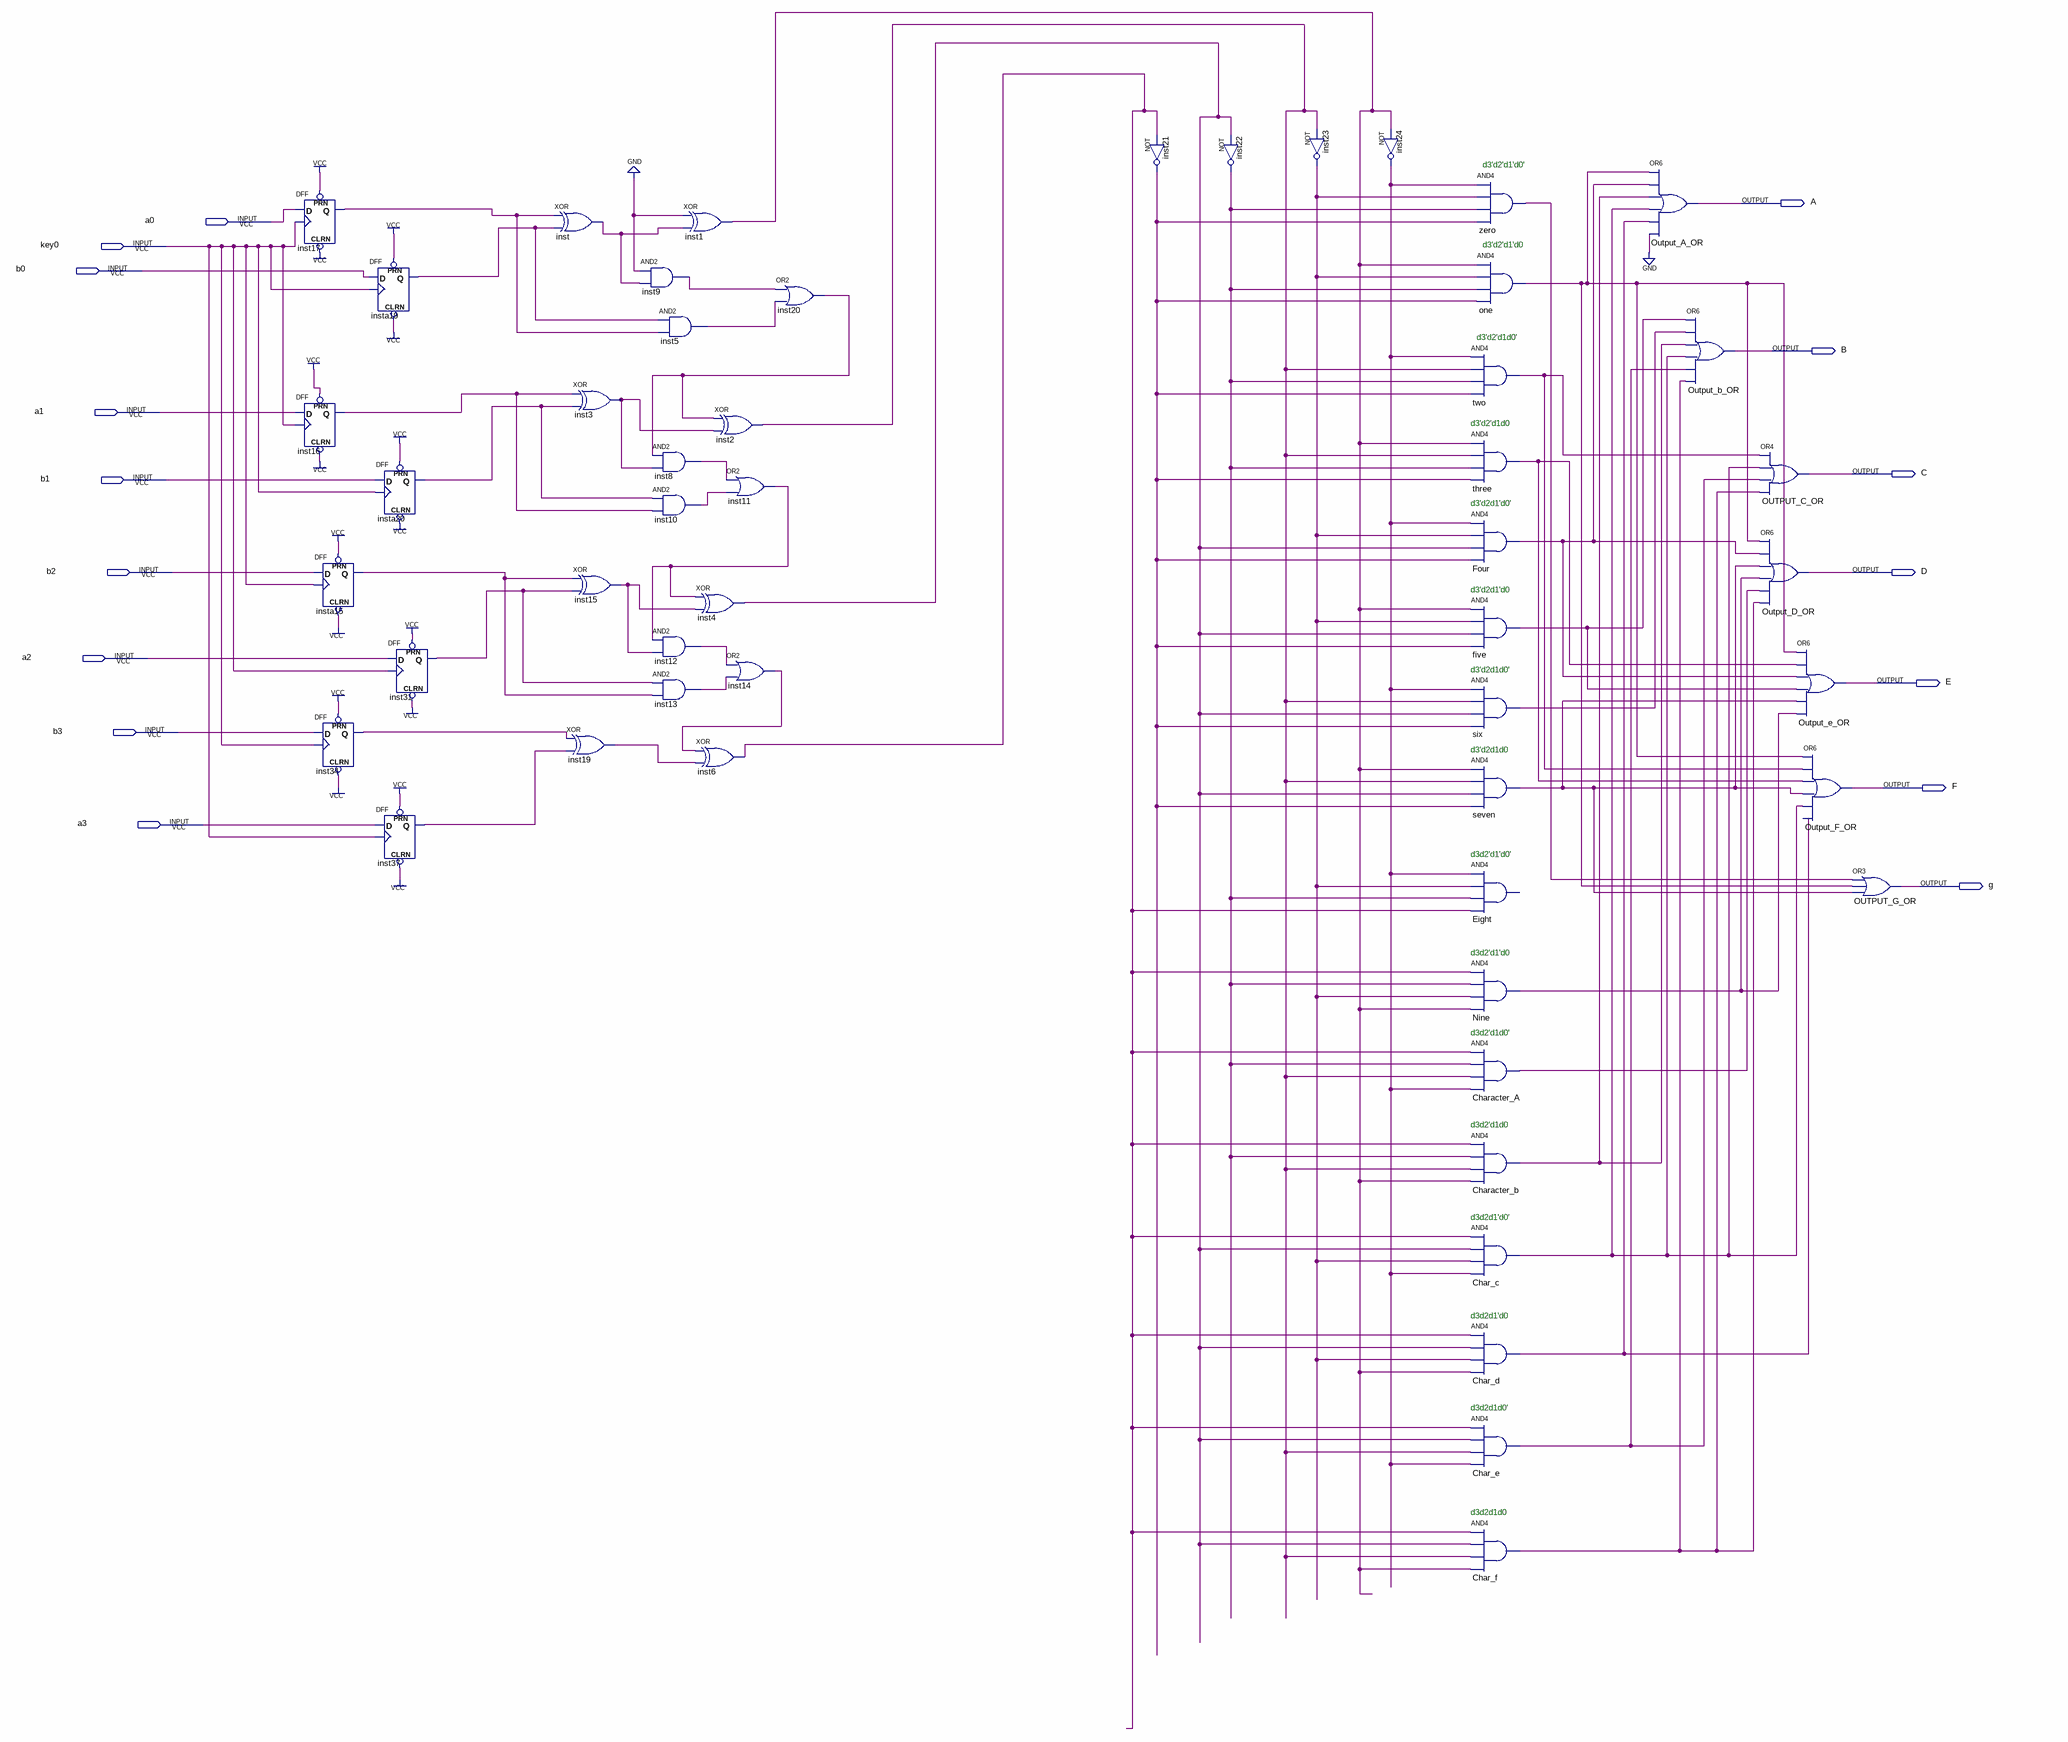
[diagram p0: schematic sheet]
// Quartus schematic Lab2_3.bdf as structural Verilog: 52 symbols, 16 pins
module Lab2_3 (
  input  a0,
  input  key0,
  input  b0,
  input  a1,
  input  b1,
  input  b2,
  input  a2,
  input  b3,
  input  a3,
  output A,
  output B,
  output C,
  output D,
  output E,
  output F,
  output g
);

  wire Char_c_out, Char_d_out, Char_e_out, Char_f_out, Character_A_out, Character_b_out, five_out, Four_out,
       inst1_out, inst2_out, inst3_out, inst4_out, inst5_out, inst6_out, inst8_out, inst9_out, inst10_out,
       inst11_out, inst12_out, inst13_out, inst14_out, inst15_out, inst16_q, inst17_q, inst19_out,
       inst20_out, inst21_out, inst22_out, inst23_out, inst24_out, inst31_q, inst34_q, inst37_q, inst_out,
       insta15_q, insta19_q, insta20_q, Nine_out, one_out, seven_out, six_out, three_out, two_out, zero_out;

  DFF inst17 (.CLRN(1'b1), .CLK(key0), .D(a0), .PRN(1'b1), .Q(inst17_q));
  DFF inst16 (.CLRN(1'b1), .CLK(key0), .D(a1), .PRN(1'b1), .Q(inst16_q));
  DFF insta15 (.CLRN(1'b1), .CLK(key0), .D(b2), .PRN(1'b1), .Q(insta15_q));
  DFF inst34 (.CLRN(1'b1), .CLK(key0), .D(b3), .PRN(1'b1), .Q(inst34_q));
  DFF insta19 (.CLRN(1'b1), .CLK(key0), .D(b0), .PRN(1'b1), .Q(insta19_q));
  DFF insta20 (.CLRN(1'b1), .CLK(key0), .D(b1), .PRN(1'b1), .Q(insta20_q));
  DFF inst31 (.CLRN(1'b1), .CLK(key0), .D(a2), .PRN(1'b1), .Q(inst31_q));
  DFF inst37 (.CLRN(1'b1), .CLK(key0), .D(a3), .PRN(1'b1), .Q(inst37_q));
  xor inst (inst_out, inst17_q, insta19_q);
  xor inst3 (inst3_out, inst16_q, insta20_q);
  xor inst15 (inst15_out, insta15_q, inst31_q);
  xor inst19 (inst19_out, inst34_q, inst37_q);
  and inst9 (inst9_out, 1'b0, inst_out);
  xor inst1 (inst1_out, 1'b0, inst_out);
  and inst5 (inst5_out, insta19_q, inst17_q);
  and inst8 (inst8_out, inst20_out, inst3_out);
  and inst10 (inst10_out, insta20_q, inst16_q);
  xor inst4 (inst4_out, inst11_out, inst15_out);
  and inst12 (inst12_out, inst11_out, inst15_out);
  and inst13 (inst13_out, inst31_q, insta15_q);
  xor inst6 (inst6_out, inst14_out, inst19_out);
  xor inst2 (inst2_out, inst20_out, inst3_out);
  or inst11 (inst11_out, inst8_out, inst10_out);
  or inst14 (inst14_out, inst12_out, inst13_out);
  or inst20 (inst20_out, inst9_out, inst5_out);
  not inst21 (inst21_out, inst6_out);
  not inst22 (inst22_out, inst4_out);
  not inst23 (inst23_out, inst2_out);
  not inst24 (inst24_out, inst1_out);
  and zero (zero_out, inst24_out, inst23_out, inst22_out, inst21_out);
  and one (one_out, inst1_out, inst23_out, inst22_out, inst21_out);
  and two (two_out, inst24_out, inst2_out, inst22_out, inst21_out);
  and three (three_out, inst1_out, inst2_out, inst22_out, inst21_out);
  and Four (Four_out, inst24_out, inst23_out, inst4_out, inst21_out);
  and five (five_out, inst1_out, inst23_out, inst4_out, inst21_out);
  and six (six_out, inst24_out, inst2_out, inst4_out, inst21_out);
  and seven (seven_out, inst1_out, inst2_out, inst4_out, inst21_out);
  // AND4 Eight has open pins: IN1=inst24_out, IN2=inst23_out, IN3=inst22_out, IN4=inst6_out, OUT=open
  and Nine (Nine_out, inst6_out, inst22_out, inst23_out, inst1_out);
  and Character_A (Character_A_out, inst6_out, inst22_out, inst2_out, inst24_out);
  and Character_b (Character_b_out, inst6_out, inst22_out, inst2_out, inst1_out);
  and Char_c (Char_c_out, inst6_out, inst4_out, inst23_out, inst24_out);
  and Char_d (Char_d_out, inst6_out, inst4_out, inst23_out, inst1_out);
  and Char_e (Char_e_out, inst6_out, inst4_out, inst2_out, inst24_out);
  and Char_f (Char_f_out, inst6_out, inst4_out, inst2_out, inst1_out);
  or Output_A_OR (A, one_out, Four_out, Character_b_out, Char_c_out, Char_d_out, 1'b0);
  or Output_b_OR (B, five_out, six_out, Character_b_out, Char_c_out, Char_e_out, Char_f_out);
  or OUTPUT_C_OR (C, two_out, Char_c_out, Char_e_out, Char_f_out);
  or Output_D_OR (D, one_out, Four_out, seven_out, Nine_out, Character_A_out, Char_f_out);
  or Output_e_OR (E, one_out, three_out, Four_out, five_out, seven_out, Nine_out);
  or Output_F_OR (F, one_out, two_out, three_out, seven_out, Char_c_out, Char_d_out);
  or OUTPUT_G_OR (g, zero_out, one_out, seven_out);

  // Notes on the sheet:
  //   d3'd2'd1'd0'
  //   d3'd2'd1'd0
  //   d3'd2'd1d0'
  //   d3'd2'd1d0
  //   d3'd2d1'd0'
  //   d3'd2d1'd0
  //   d3'd2d1d0'
  //   d3'd2d1d0
  //   d3d2'd1'd0'
  //   d3d2'd1'd0
  //   d3d2'd1d0'
  //   d3d2'd1d0
  //   d3d2d1'd0'
  //   d3d2d1'd0
  //   d3d2d1d0'
  //   d3d2d1d0
endmodule
